# Altium schematic sheet dsp-control.SchDoc
size 594 x 420 mm; Address1: Address1; Address2: Address2; Address3: Address3; Address4: Address4; DocumentNumber: АБВГ.123456.001 Э3; SheetNumber: 2; SheetTotal: 2; Scale: 1:1; DocumentType: Схема электрическая принципиальная; FirstReferrence: АБВГ.123456.001
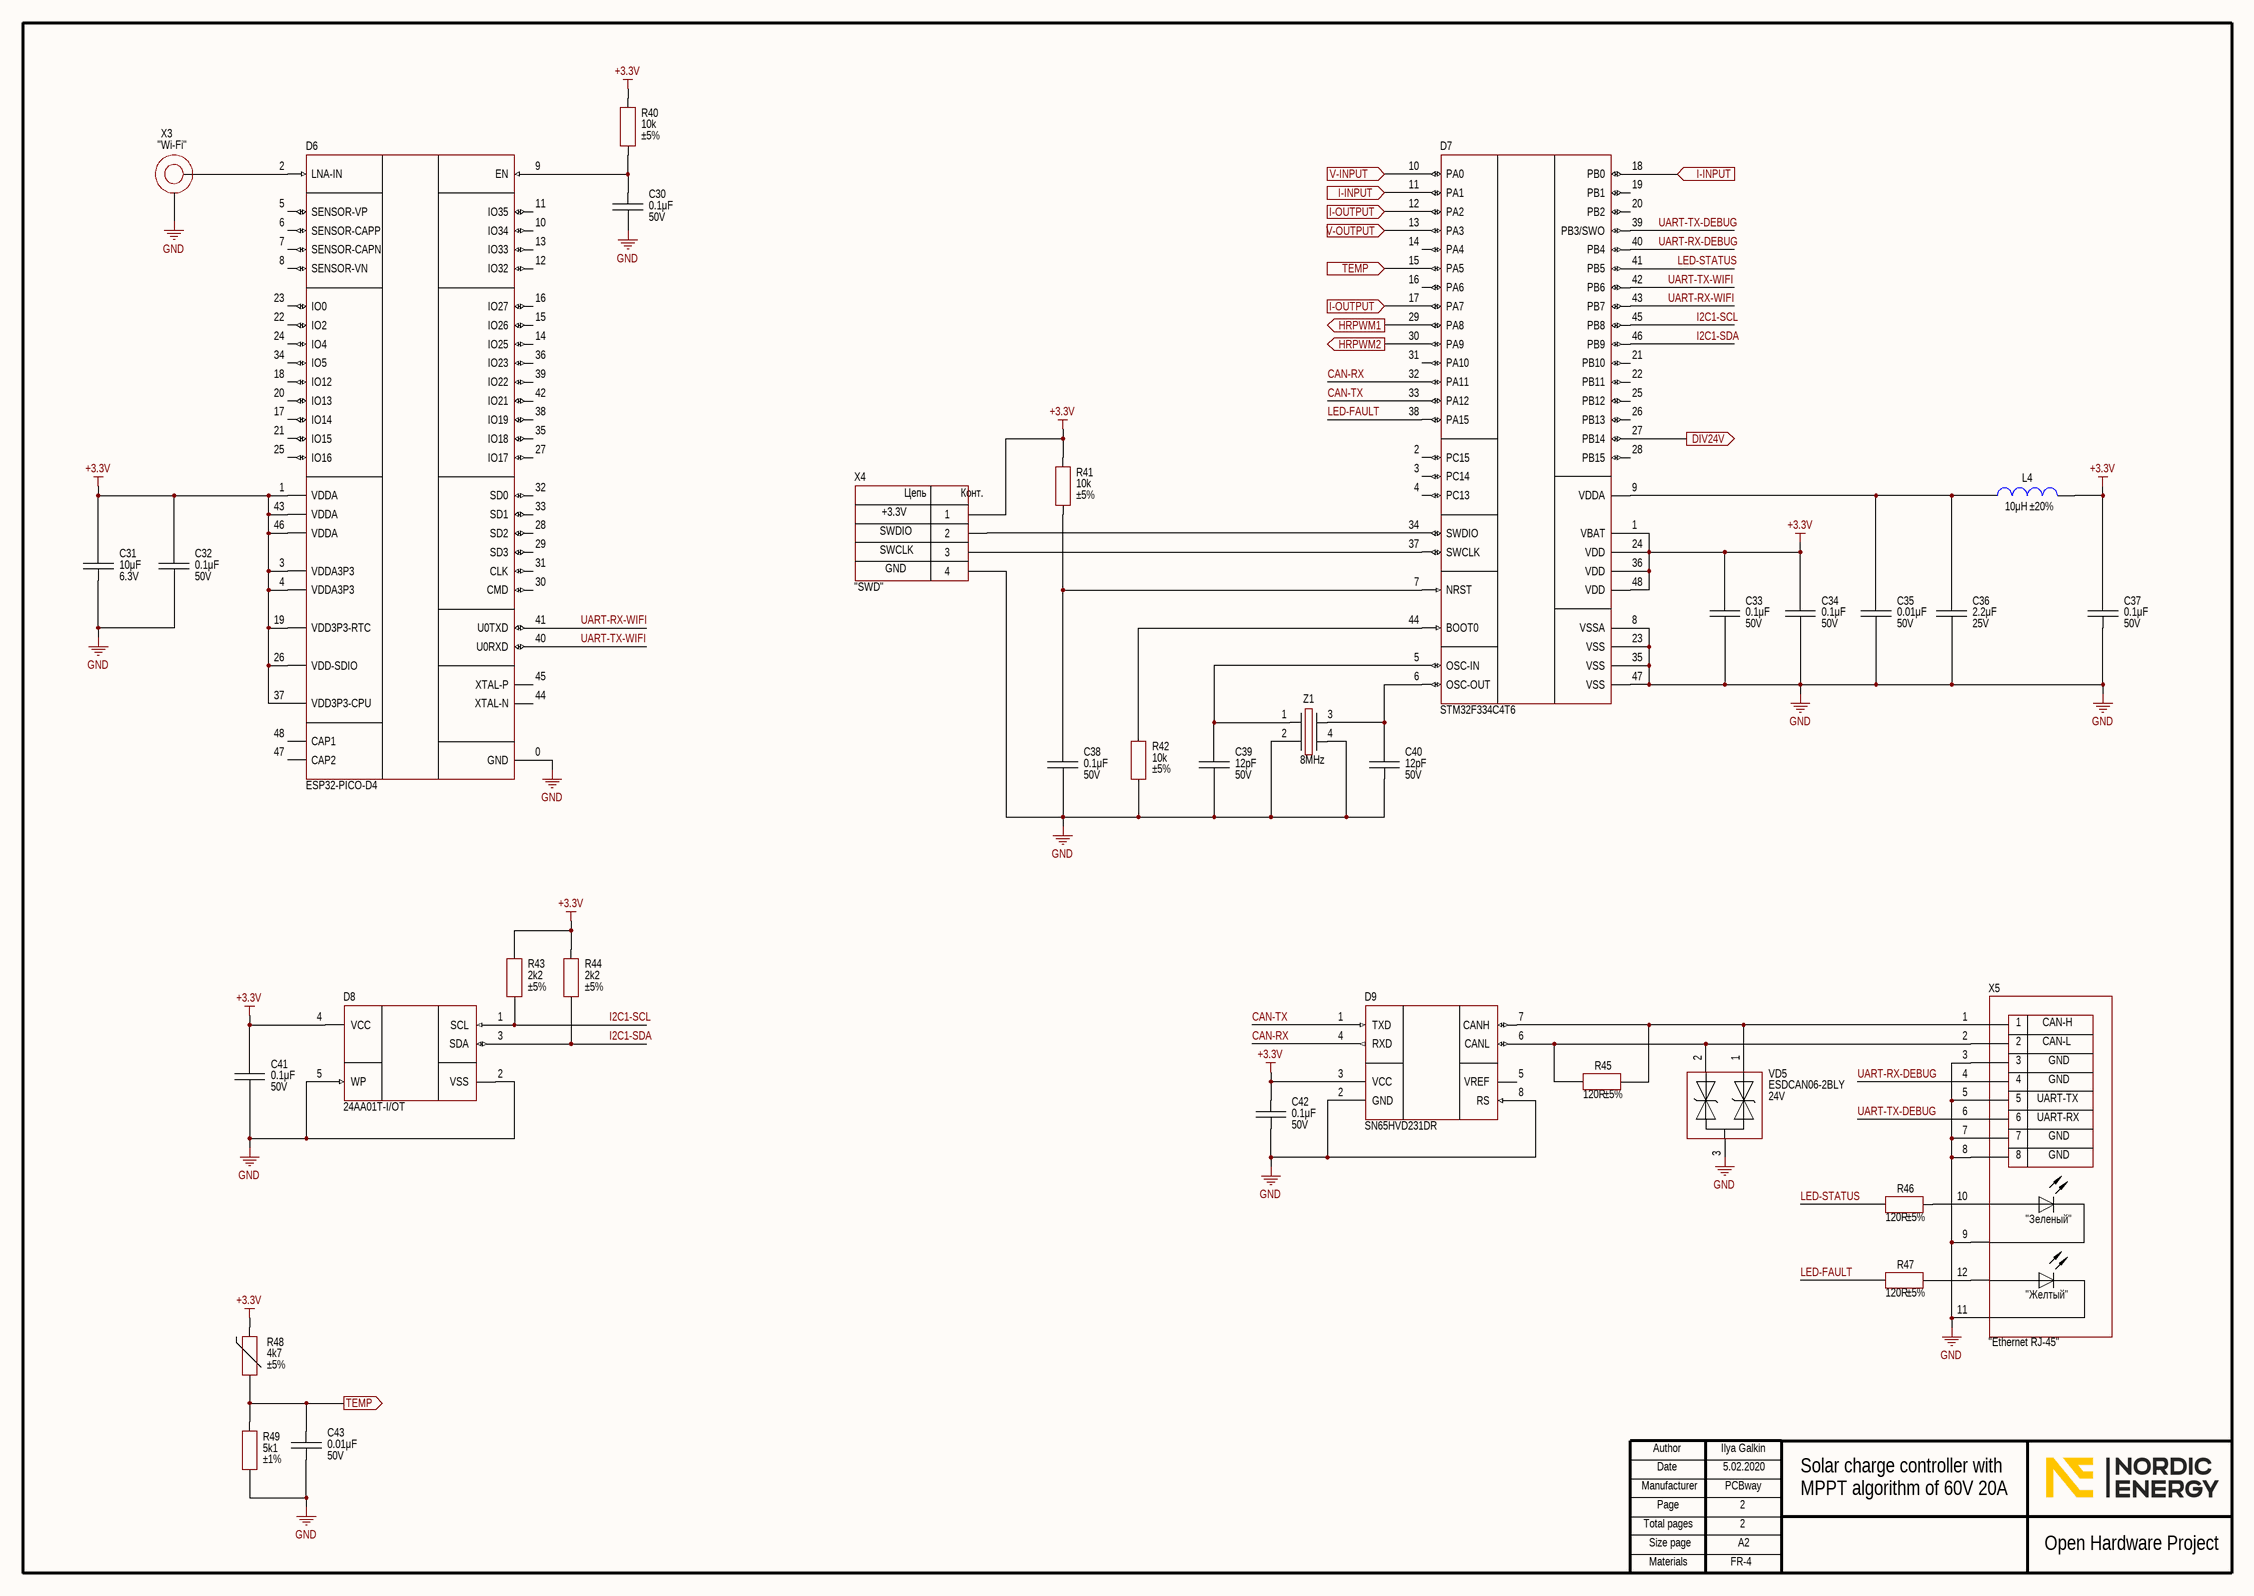
[diagram p0: dsp-control.SchDoc]

## Parts
C30  value 0.1μF  Voltage: 50V  [CAP: 0805]
C31  value 10μF  Voltage: 6.3V  [CAP: 0805]
C32  value 0.1μF  Voltage: 50V  [CAP: 0805]
C33  value 0.1μF  Voltage: 50V  [CAP: 0805]
C34  value 0.1μF  Voltage: 50V  [CAP: 0805]
C35  value 0.01μF  Voltage: 50V  [CAP: 0805]
C36  value 2.2μF  Voltage: 25V  [CAP: 0805]
C37  value 0.1μF  Voltage: 50V  [CAP: 0805]
C38  value 0.1μF  Voltage: 50V  [CAP: 0805]
C39  value 12pF  Voltage: 50V  [CAP: 0805]
C40  value 12pF  Voltage: 50V  [CAP: 0805]
C41  value 0.1μF  Voltage: 50V  [CAP: 0805]
C42  value 0.1μF  Voltage: 50V  [CAP: 0805]
C43  value 0.01μF  Voltage: 50V  [CAP: 0805]
D6  (no value)  [48-LGA (7x7)]
D7  (no value)  [48-LQFP]
D8  PartNumber: 24AA01T-I/OT  [SOT23-5]
D9  (no value)  [8-SOIC]
L4  value 10μH  Tolerance: ±20%  [IND: 0805]
R40  value 10k  Tolerance: ±5%  [RES: 0805]
R41  value 10k  Tolerance: ±5%  [RES: 0805]
R42  value 10k  Tolerance: ±5%  [RES: 0805]
R43  value 2k2  Tolerance: ±5%  [RES: 0805]
R44  value 2k2  Tolerance: ±5%  [RES: 0805]
R45  value 120R  Tolerance: ±5%  [RES: 0805]
R46  value 120R  Tolerance: ±5%  [RES: 0805]
R47  value 120R  Tolerance: ±5%  [RES: 0805]
R48  value 4k7  Tolerance: ±5%  [RES: 0805]
R49  value 5k1  Tolerance: ±1%  [RES: 0805]
VD5  Voltage: 24V  PartNumber: ESDCAN06-2BLY  [SOT23]
X3  CommentText: "Wi-Fi"  [CON: u.Fl]
X4  CommentText: "SWD"  [CON: SM04B-GHS]
X5  CommentText: "Ethernet RJ-45"  [CON: RJ-45 (615008137421 / DS1128-09-S8B8S)]
Z1  Frequency: 8MHz  [OSC: 3225]

## Ports
DIV24V (out), HRPWM1 (out), HRPWM2 (out), I-INPUT (in), I-OUTPUT (in), TEMP (in), TEMP (out), V-INPUT (in), V-OUTPUT (in)

## Nets
+3.3V: C31.2 C32.2 C33.2 C34.2 C37.2 C41.2 C42.2 D6.1(VDDA) D6.3(VDDA3P3) D6.4(VDDA3P3) D6.19(VDD3P3-RTC) D6.26(VDD-SDIO) D6.37(VDD3P3-CPU) D6.43(VDDA) D6.46(VDDA) D7.1(VBAT) D7.24(VDD) D7.36(VDD) D7.48(VDD) D8.4(VCC) D9.3(VCC) L4.1 R40.2 R41.2 R43.2 R44.2 R48.2 X4.1
GND: C30.1 C31.1 C32.1 C33.1 C34.1 C35.1 C36.1 C37.1 C38.1 C39.1 C40.1 C41.1 C42.1 C43.1 D6.0(GND) D7.8(VSSA) D7.23(VSS) D7.35(VSS) D7.47(VSS) D8.2(VSS) D8.5(WP) D9.2(GND) D9.8(RS) R42.1 R49.1 VD5.3 X3.2 X4.4 X5.3(D2) X5.5(D2) X5.7(D2) X5.8(D2) X5.9(D2) X5.11(D3) Z1.2 Z1.4
CAN-RX: D7.32(PA11) D9.4(RXD)
CAN-TX: D7.33(PA12) D9.1(TXD)
DIV24V: D7.27(PB14) ; port DIV24V
HRPWM1: D7.29(PA8) ; port HRPWM1
HRPWM2: D7.30(PA9) ; port HRPWM2
I2C1-SCL: D7.45(PB8) D8.1(SCL) R43.1
I2C1-SDA: D7.46(PB9) D8.3(SDA) R44.1
I-INPUT: D7.11(PA1) D7.18(PB0) ; port I-INPUT
I-OUTPUT: D7.12(PA2) D7.17(PA7) ; port I-OUTPUT
LED-FAULT: D7.38(PA15) R47.2
LED-STATUS: D7.41(PB5) R46.2
TEMP: C43.2 D7.15(PA5) R48.1 R49.2 ; port TEMP
UART-RX-DEBUG: D7.40(PB4) X5.4(D2)
UART-RX-WIFI: D6.41(U0TXD) D7.43(PB7)
UART-TX-DEBUG: D7.39(PB3/SWO) X5.6(D2)
UART-TX-WIFI: D6.40(U0RXD) D7.42(PB6)
V-INPUT: D7.10(PA0) ; port V-INPUT
V-OUTPUT: D7.13(PA3) ; port V-OUTPUT
NetC30_2: C30.2 D6.9(EN) R40.1
NetC35_2: C35.2 C36.2 D7.9(VDDA) L4.2
NetC38_2: C38.2 D7.7(NRST) R41.1
NetC39_2: C39.2 D7.5(OSC-IN) Z1.1
NetC40_2: C40.2 D7.6(OSC-OUT) Z1.3
NetD6_2: D6.2(LNA-IN) X3.1
NetD7_34: D7.34(SWDIO) X4.2
NetD7_37: D7.37(SWCLK) X4.3
NetD7_44: D7.44(BOOT0) R42.2
NetD9_6: D9.6(CANL) R45.2 VD5.2 X5.2(D2)
NetD9_7: D9.7(CANH) R45.1 VD5.1 X5.1(D2)
NetR46_1: R46.1 X5.10(D1)
NetR47_1: R47.1 X5.12(D4)

Not connected (* = marked no-connect by the designer): D6 5(SENSOR-VP) 6(SENSOR-CAPP) 7(SENSOR-CAPN) 8(SENSOR-VN) 10(IO34) 11(IO35) 12(IO32) 13(IO33) 14(IO25) 15(IO26) 16(IO27) 17(IO14) 18(IO12) 20(IO13) 21(IO15) 22(IO2) 23(IO0) 24(IO4) 25(IO16) 27(IO17) 28(SD2) 29(SD3) 30(CMD) 31(CLK) 32(SD0) 33(SD1) 34(IO5) 35(IO18) 36(IO23) 38(IO19) 39(IO22) 42(IO21) 44(XTAL-N) 45(XTAL-P) 47(CAP2) 48(CAP1); D7 2(PC15) 3(PC14) 4(PC13) 14(PA4) 16(PA6) 19(PB1) 20(PB2) 21(PB10) 22(PB11) 25(PB12) 26(PB13) 28(PB15) 31(PA10); D9 5(VREF)

## Notes on the sheet
- SWCLK
- SWDIO
- +3.3V
- GND
- CAN-H
- CAN-L
- UART-TX
- UART-RX
- Ilya Galkin
- 5.02.2020
- PCBway
- 2
- Solar charge controller with
- MPPT algorithm of 60V 20A
- FR-4
- Author
- Manufacturer
- Date
- Page
- Total pages
- Size page
- A2
- Open Hardware Project
- Materials
- (in symbol Connector_RJ45) "Зеленый"; "Желтый"
- (in symbol Connector_SM04B) Цепь; Конт.

## Library data of the parts
C30 C32-C34 C37 C38 C41 C42 = Ceramic_0805: Manufacturer: Samsung; PartNumber: CL21B104KBCNFNC; ValueManufacturerPartNumber: Ceramic capacitor, 0.1μF, X7R, ±10%, 50V, 0805, -55...+125°C; TypeCapacitor: Ceramic capacitor; Tolerance: ±10%; TypeDielectric: X7R; Package: 0805; HelpURL: https://www.digikey.com/product-detail/en/samsung-electro-mechanics/CL21B104KBCNFNC/1276-2444-1-ND/3890530; Temperature: -55...+125°C
C31 = Ceramic_0805: Manufacturer: Samsung; PartNumber: CL21B106KQQNNNG; ValueManufacturerPartNumber: Ceramic capacitor, 10μF, X7R, ±10%, 6.3V, 0805, -55...+125°C; TypeCapacitor: Ceramic capacitor; Tolerance: ±10%; TypeDielectric: X7R; Package: 0805; HelpURL: https://www.digikey.com/product-detail/en/samsung-electro-mechanics/CL21B106KQQNNNG/1276-6474-1-ND/5958102; Temperature: -55...+125°C
C35 C43 = Ceramic_0805: Manufacturer: Samsung; PartNumber: CL21B103KBANNNC; ValueManufacturerPartNumber: Ceramic capacitor, 0.01μF, X7R, ±10%, 50V, 0805, -55...+125°C; TypeCapacitor: Ceramic capacitor; Tolerance: ±10%; TypeDielectric: X7R; Package: 0805; HelpURL: https://www.digikey.com/product-detail/en/samsung-electro-mechanics/CL21B103KBANNNC/1276-1015-1-ND/3889101; Temperature: -55...+125°C
C36 = Ceramic_0805: Manufacturer: Samsung; PartNumber: CL21B225KAFNFNE; ValueManufacturerPartNumber: Ceramic capacitor, 2.2μF, X7R, ±10%, 25V, 0805, -55...+125°C; TypeCapacitor: Ceramic capacitor; Tolerance: ±10%; TypeDielectric: X7R; Package: 0805; HelpURL: https://www.digikey.com/product-detail/en/samsung-electro-mechanics/CL21B225KAFNFNE/1276-2953-1-ND/3891039; Temperature: -55...+125°C
C39 C40 = Ceramic_0805: Manufacturer: Samsung; PartNumber: CL21C120JBANNNC; ValueManufacturerPartNumber: Ceramic capacitor, 12pF, NPO, ±5%, 50V, 0805, -55...+125°C; TypeCapacitor: Ceramic capacitor; Tolerance: ±5%; TypeDielectric: NPO; Package: 0805; HelpURL: https://www.digikey.com/product-detail/en/samsung-electro-mechanics/CL21C120JBANNNC/1276-1120-1-ND/3889206; Temperature: -55...+125°C
D6 = ESP32-PICO-D4: Wi-Fi+BT; Manufacturer: Espressif Systems; ValueManufacturerPartNumber: IC RF transceiver, 802.11b/g/n + Bluetooth v4.2, 2.4GHz, 32-Bit, Xtensa LX6, 4Mb, 520KB, 2.7...3.6V, -40...+85°C, 48-LGA; Supply: 2.7...3.6V; CoreSpeed: 600 DMIPS; CoreSize: 32-Bit; MemoryROM: 4Mb; MemoryRAM: 520KB; CoreProcessor: Xtensa LX6; Frequency: 2.4GHz; TypeProtocol: 802.11b/g/n + Bluetooth v4.2; HelpURL: https://www.digikey.com/product-detail/en/espressif-systems/ESP32-PICO-D4/1904-1029-1-ND/9381738; Package: 48-LGA; ComponentType: IC RF transceiver; Temperature: -40...+85°C; PartNumber: ESP32-PICO-D4
D7 = STM32F334C4T6: Cortex-M4; Manufacturer: STMicroelectronics; ValueManufacturerPartNumber: IC microcontroller, 32-Bit, Cortex-M4, 72MHz, 16KB, 12KB, 2...3.6V, -40...+85°C, 48-LQFP; Supply: 2...3.6V; Speed: 72MHz; CoreSize: 32-Bit; MemoryROM: 16KB; MemoryRAM: 12KB; HelpURL: https://www.digikey.com/products/en?keywords=STM32F334C4T6; Package: 48-LQFP; ComponentType: IC microcontroller; Temperature: -40...+85°C; CoreProcessor: Cortex-M4; PartNumber: STM32F334C4T6
D8 = 24AA01T: EEPROM; Manufacturer: Microchip Technology; ValueManufacturerPartNumber: IC memory, EEPROM, 1KB (128x8), 400 kHz, I2C, 1.7...5.5V, -40...+85°C, SOT-23-5; Supply: 1.7...5.5V; Speed: 400 kHz; InterfaceData: I2C; MemorySize: 1KB (128x8); HelpURL: https://www.digikey.com/product-detail/en/microchip-technology/24AA01T-I-OT/24AA01T-I-OTCT-ND/857670; Package: SOT-23-5; ComponentType: IC memory; Temperature: -40...+85°C; MemoryType: EEPROM
D9 = SN65HVD231DR: CAN; Manufacturer: Texas Instruments; ValueManufacturerPartNumber: IC CAN transceiver, 1Mbps, Half-duplex, 3...3.6V, -40...+85°C, 8-SOIC; Supply: 3...3.6V; DataRate: 1Mbps; TypeDuplex: Half-duplex; HelpURL: https://www.digikey.com/product-detail/en/texas-instruments/SN65HVD231DR/296-26343-1-ND/2254977; Package: 8-SOIC; ComponentType: IC CAN transceiver; Temperature: -40...+85°C; PartNumber: SN65HVD231DR
L4 = Inductor_0805: Manufacturer: Murata Electronics; PartNumber: LQM21DH100M70L; ValueManufacturerPartNumber: Fixed inductor, 10μH, ±20%, 0805, 250mA, -55...+125°C; TypeInductor: Fixed inductor; MaxCurrent: 250mA; Package: 0805; HelpURL: https://www.digikey.com/product-detail/en/murata-electronics/LQM21DH100M70L/490-18463-1-ND/10135474; Temperature: -55...+125°C
R40-R42 = Resistor_0805: Manufacturer: Yageo; PartNumber: RC0805JR-0710KL; ValueManufacturerPartNumber: Resistor film, 10k, ±5%, 0805, 0.125W, -55...+125°C; TypeResistor: Resistor film; Power: 0.125W; Package: 0805; HelpURL: https://www.digikey.com/product-detail/en/yageo/RC0805JR-0710KL/311-10KARCT-ND/731188; Temperature: -55...+125°C
R43 R44 = Resistor_0805: Manufacturer: Yageo; PartNumber: RC0805JR-072K2L; ValueManufacturerPartNumber: Resistor film, 2k2, ±5%, 0805, 0.125W, -55...+125°C; TypeResistor: Resistor film; Power: 0.125W; Package: 0805; HelpURL: https://www.digikey.com/product-detail/en/yageo/RC0805JR-072K2L/311-2.2KARCT-ND/731218; Temperature: -55...+125°C
R45-R47 = Resistor_0805: Manufacturer: Yageo; PartNumber: RC0805JR-07120RL; ValueManufacturerPartNumber: Resistor film, 120R, ±5%, 0805, 0.125W, -55...+125°C; TypeResistor: Resistor film; Power: 0.125W; Package: 0805; HelpURL: https://www.digikey.com/product-detail/en/yageo/RC0805JR-07120RL/311-120ARCT-ND/731194; Temperature: -55...+125°C
R48 = NTC: Manufacturer: TDK; PartNumber: B57401V2472J062; ValueManufacturerPartNumber: NTC resistor, 4k7, ±5%, 0805, 3650K, -55...+125°C; TypeResistor: NTC resistor; MaxCurrent: 3650K; Package: 0805; HelpURL: https://www.digikey.com/product-detail/en/tdk-electronics-inc/B57401V2472J062/495-7444-1-ND/6073136; Temperature: -55...+125°C
R49 = Resistor_0805: Manufacturer: Yageo; PartNumber: RC0805FR-075K1L; ValueManufacturerPartNumber: Resistor film, 5k1, ±1%, 0805, 0.125W, -55...+125°C; TypeResistor: Resistor film; Power: 0.125W; Package: 0805; HelpURL: https://www.digikey.com/product-detail/en/yageo/RC0805FR-075K1L/311-5.10KCRCT-ND/730935; Temperature: -55...+125°C
VD5 = TVS_array: Manufacturer: STMicroelectronics; ValueManufacturerPartNumber: TVS diode, 24V, 230W peak, 3A, 13pF, SOT-23, -40...+150°C; TypeDiode: TVS diode; Current: 230W peak; VoltageDrop: 3A; RecoveryTime: 13pF; Package: SOT-23; HelpURL: https://www.digikey.com/product-detail/en/stmicroelectronics/ESDCAN06-2BLY/497-19090-1-ND/10057130; Temperature: -40...+150°C
X3 = Connector_uFL: Manufacturer: Hirose Electric; ValueManufacturerPartNumber: Connector u.FL, 50 Ohm, 6GHz; PartNumber: U.FL-R-SMT(01); TypeConnector: Connector u.FL; Frequency: 6GHz; Impedance: 50 Ohm; HelpURL: https://www.digikey.com/product-detail/en/hirose-electric-co-ltd/U.FL-R-SMT-01/H9161-ND/513010
X4 = Connector_SM04B: Manufacturer: JST; ValueManufacturerPartNumber: Connector, 4pin, 1.25mm, 50VDC, 1A; PartNumber: SM04B-GHS; VoltageMax: 50VDC; Pitch: 1.25mm; CurrentMax: 1A; Multichannel: 4pin; HelpURL: https://www.digikey.com/product-detail/en/jst-sales-america-inc/SM04B-GHS-TB-LF-SN/455-1566-1-ND/807834; TypeConnector: Connector
X5 = Connector_RJ45: Manufacturer: Wurth; ValueManufacturerPartNumber: Etherner RJ-45 connector; PartNumber: 615008137421; AnalogComponent: DS1128-09-S8B8S (Connfly); HelpURL: https://www.digikey.com/product-detail/en/w-rth-elektronik/615008137421/732-2112-ND/2060608; TypeConnector: Etherner RJ-45 connector
Z1 = Crystal_3225: Manufacturer: ECS; PartNumber: ECS-80-12-33-JGN-TR; ValueManufacturerPartNumber: Crystal, 8MHz, 12pF, ±30ppm, case 3225, -40...+85°C; LoadCapacitance: 12pF; Tolerance: ±30ppm; Package: case 3225; HelpURL: https://www.digikey.com/product-detail/en/ecs-inc/ECS-80-12-33-JGN-TR/50-ECS-80-12-33-JGN-CT-ND/10478769; Temperature: -40...+85°C; TypeOscilator: Crystal